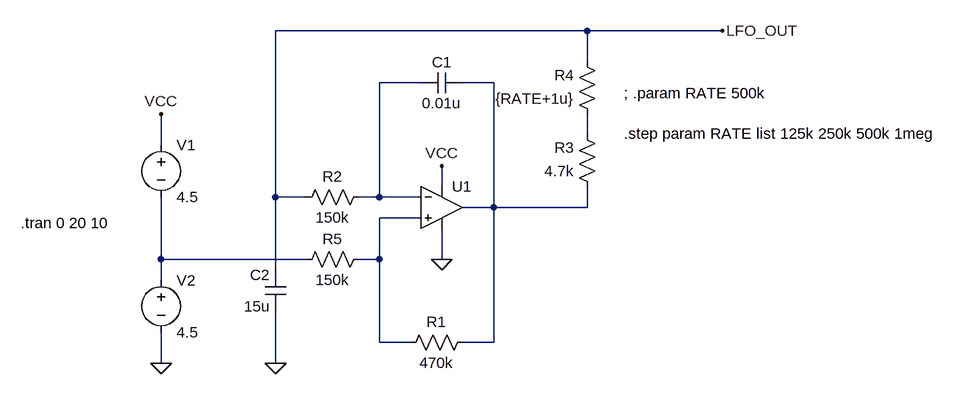
[diagram p0: schematic LFO_MXR.asc]
LFO_MXR.asc, the LTspice schematic file:
Version 4
SHEET 1 1104 680
WIRE 464 -96 -16 -96
WIRE 672 -96 464 -96
WIRE 464 -48 464 -96
WIRE 208 -16 144 -16
WIRE 320 -16 272 -16
WIRE 464 64 464 32
WIRE -192 80 -192 32
WIRE 240 144 240 112
WIRE -16 160 -16 -96
WIRE 32 160 -16 160
WIRE 144 160 144 -16
WIRE 144 160 112 160
WIRE 208 160 144 160
WIRE 320 176 320 -16
WIRE 320 176 272 176
WIRE 464 176 464 144
WIRE 464 176 320 176
WIRE 208 192 144 192
WIRE -192 256 -192 160
WIRE 32 256 -192 256
WIRE 144 256 144 192
WIRE 144 256 112 256
WIRE 240 256 240 208
WIRE -16 272 -16 160
WIRE -192 288 -192 256
WIRE 144 384 144 256
WIRE 192 384 144 384
WIRE 320 384 320 176
WIRE 320 384 272 384
WIRE -192 416 -192 368
WIRE -16 416 -16 336
FLAG -16 416 0
FLAG 240 256 0
FLAG -192 416 0
FLAG -192 32 VCC
FLAG 240 112 VCC
FLAG 672 -96 LFO_OUT
SYMBOL Opamps\\UniversalOpamp2 240 176 R0
SYMATTR InstName U1
SYMBOL res 288 368 R90
WINDOW 0 0 56 VBottom 2
WINDOW 3 32 56 VTop 2
SYMATTR InstName R1
SYMATTR Value 470k
SYMBOL res 128 144 R90
WINDOW 0 0 56 VBottom 2
WINDOW 3 32 56 VTop 2
SYMATTR InstName R2
SYMATTR Value 150k
SYMBOL res 480 160 R180
WINDOW 0 36 76 Left 2
WINDOW 3 36 40 Left 2
SYMATTR InstName R3
SYMATTR Value 4.7k
SYMBOL res 480 48 R180
WINDOW 0 36 76 Left 2
WINDOW 3 36 40 Left 2
SYMATTR InstName R4
SYMATTR Value {RATE+1u}
SYMBOL cap 272 -32 R90
WINDOW 0 0 32 VBottom 2
WINDOW 3 32 32 VTop 2
SYMATTR InstName C1
SYMATTR Value 0.01u
SYMBOL cap 0 336 R180
WINDOW 0 24 56 Left 2
WINDOW 3 24 8 Left 2
SYMATTR InstName C2
SYMATTR Value 15u
SYMBOL voltage -192 64 R0
WINDOW 123 0 0 Left 2
WINDOW 39 0 0 Left 2
SYMATTR InstName V1
SYMATTR Value 4.5
SYMBOL voltage -192 272 R0
WINDOW 123 0 0 Left 2
WINDOW 39 0 0 Left 2
SYMATTR InstName V2
SYMATTR Value 4.5
SYMBOL res 128 240 R90
WINDOW 0 0 56 VBottom 2
WINDOW 3 32 56 VTop 2
SYMATTR InstName R5
SYMATTR Value 150k
TEXT -408 200 Left 2 !.tran 0 20 10
TEXT 520 0 Left 2 !; .param RATE 500k\n \n.step param RATE list 125k 250k 500k 1meg

The netlist it stands for:
* LFO_MXR.asc
XU1 N004 N001 VCC 0 N002 level.2 Avol=1Meg GBW=10Meg Slew=10Meg ilimit=25m rail=0 Vos=0 phimargin=45 en=0 enk=0 in=0 ink=0 Rin=500Meg  ; pins IN+ IN- V+ V- OUT
R1 N002 N004 470k
R2 N001 LFO_OUT 150k
R3 N002 N003 4.7k
R4 N003 LFO_OUT {RATE+1u}
C1 N002 N001 0.01u
C2 0 LFO_OUT 15u
V1 VCC N005 4.5
V2 N005 0 4.5
R5 N004 N005 150k
.tran 0 20 10
; .param RATE 500k
.step param RATE list 125k 250k 500k 1meg
.lib UniversalOpamps2.sub
.backanno
.end